# Altium project WT32-RJ45.PrjPcb (part 2 of 2)

## Sheet LED_Sheet.SchDoc
size 420 x 297 mm; SheetNumber: 3; SheetTotal: 3
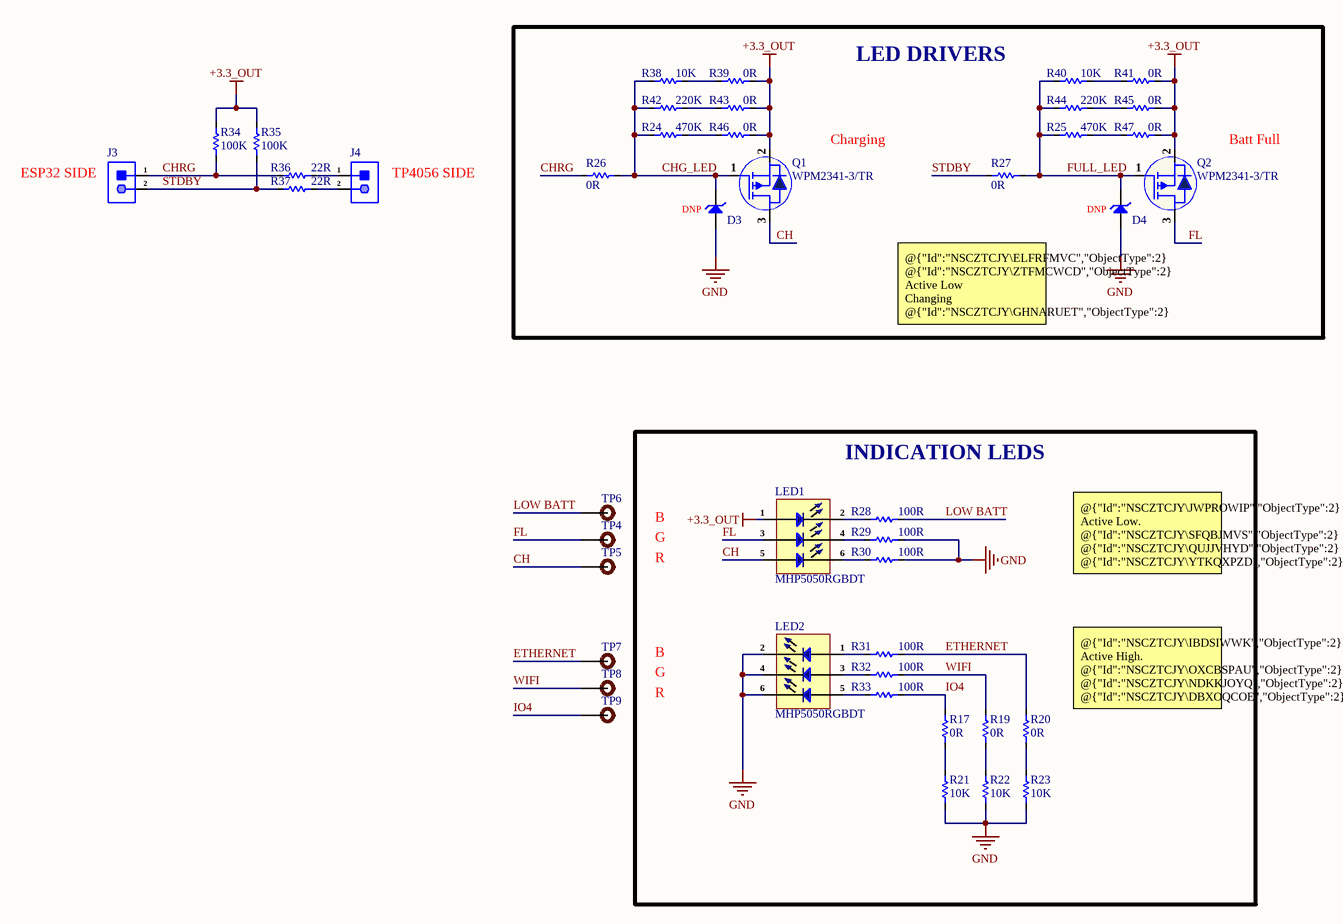
[diagram p2: LED_Sheet.SchDoc]

### Parts
D3  MM3Z3V3  [SOD-323]  (value not drawn)  (no BOM)
D4  MM3Z3V3  [SOD-323]  (value not drawn)  (no BOM)
J3  826629-2  [HDR1X2_]  (value not drawn)
J4  826629-2  [HDR1X2_]  (value not drawn)
LED1  MHP5050RGBDT  [MHP5050RGBDT]
LED2  MHP5050RGBDT  [MHP5050RGBDT]
Q1  WPM2341-3/TR  [Sot-23]
Q2  WPM2341-3/TR  [Sot-23]
R17  0R  [Res-0402]  (no BOM)
R19  0R  [Res-0402]  (no BOM)
R20  0R  [Res-0402]  (no BOM)
R21  10K  [Res-0402]
R22  10K  [Res-0402]
R23  10K  [Res-0402]
R24  470K  [Res-0402]
R25  470K  [Res-0402]
R26  0R  [Res-0402]
R27  0R  [Res-0402]
R28  100R  [Res-0402]
R29  100R  [Res-0402]
R30  100R  [Res-0402]
R31  100R  [Res-0402]
R32  100R  [Res-0402]
R33  100R  [Res-0402]
R34  100K  [Res-0402]
R35  100K  [Res-0402]
R36  22R  [Res-0402]
R37  22R  [Res-0402]
R38  10K  [Res-0402]
R39  0R  [Res-0402]  (no BOM)
R40  10K  [Res-0402]
R41  0R  [Res-0402]  (no BOM)
R42  220K  [Res-0402]
R43  0R  [Res-0402]  (no BOM)
R44  220K  [Res-0402]
R45  0R  [Res-0402]  (no BOM)
R46  0R  [Res-0402]  (no BOM)
R47  0R  [Res-0402]  (no BOM)
TP4  TEST POINT 0.5mm Dia  [Test-point - 0.5mm]  (value not drawn)  (no BOM)
TP5  TEST POINT 0.5mm Dia  [Test-point - 0.5mm]  (value not drawn)  (no BOM)
TP6  TEST POINT 0.5mm Dia  [Test-point - 0.5mm]  (value not drawn)  (no BOM)
TP7  TEST POINT 0.5mm Dia  [Test-point - 0.5mm]  (value not drawn)  (no BOM)
TP8  TEST POINT 0.5mm Dia  [Test-point - 0.5mm]  (value not drawn)  (no BOM)
TP9  TEST POINT 0.5mm Dia  [Test-point - 0.5mm]  (value not drawn)  (no BOM)

### Blocks framed on the sheet
LED DRIVERS: D3 D4 Q1 Q2 R24-R27 R38-R47
INDICATION LEDS: LED1 LED2 R17 R19-R23 R28-R33

### Nets
+3.3_OUT: LED1.1 Q1.2(S) Q2.2(S) R34.2 R35.2 R39.1 R41.1 R43.1 R45.1 R46.1 R47.1
GND: D3.2(A) D4.2(A) LED2.2 LED2.4 LED2.6 R21.1 R22.1 R23.1 R29.2 R30.2
CH: LED1.5 Q1.3(D) TP5.1
CHG_LED: D3.1(K) Q1.1(G) R24.1 R26.2 R38.2 R42.1
CHRG: J3.1 R26.1 R34.1 R36.1
ETHERNET: R20.2 R31.2 TP7.1
FL: LED1.3 Q2.3(D) TP4.1
FULL_LED: D4.1(K) Q2.1(G) R25.1 R27.2 R40.2 R44.1
IO4: R17.2 R33.2 TP9.1
LOW BATT: R28.2 TP6.1
STDBY: J3.2 R27.1 R35.1 R37.1
WIFI: R19.2 R32.2 TP8.1
NetJ4_1: J4.1 R36.2
NetJ4_2: J4.2 R37.2
NetLED1_2: LED1.2 R28.1
NetLED1_4: LED1.4 R29.1
NetLED1_6: LED1.6 R30.1
NetLED2_1: LED2.1 R31.1
NetLED2_3: LED2.3 R32.1
NetLED2_5: LED2.5 R33.1
NetR17_1: R17.1 R21.2
NetR19_1: R19.1 R22.2
NetR20_1: R20.1 R23.2
NetR24_2: R24.2 R46.2
NetR25_2: R25.2 R47.2
NetR38_1: R38.1 R39.2
NetR40_1: R40.1 R41.2
NetR42_2: R42.2 R43.2
NetR44_2: R44.2 R45.2

### Notes on the sheet
- (near J3) ESP32 SIDE
- (near J4) TP4056 SIDE
- Charging
- Batt Full
- (near D3) DNP
- (near D4) DNP
- @{"Id":"NSCZTCJY\ELFRFMVC","ObjectType":2} @{"Id":"NSCZTCJY\ZTFMCWCD","ObjectType":2} Active Low
  Changing @{"Id":"NSCZTCJY\GHNARUET","ObjectType":2} & @{"Id":"NSCZTCJY\CBAYZRLV","ObjectType":2} from 1M to 500k.
- B
- R
- G
- @{"Id":"NSCZTCJY\JWPROWIP","ObjectType":2} Active Low.
  @{"Id":"NSCZTCJY\SFQBJMVS","ObjectType":2} @{"Id":"NSCZTCJY\QUJJVHYD","ObjectType":2} @{"Id":"NSCZTCJY\YTKQXPZD","ObjectType":2} Changed from 470R to 100R
- (near R20) @{"Id":"NSCZTCJY\IBDSIWWK","ObjectType":2} Active High.
  @{"Id":"NSCZTCJY\OXCBSPAU","ObjectType":2} @{"Id":"NSCZTCJY\NDKKJOYQ","ObjectType":2} @{"Id":"NSCZTCJY\DBXOQCOE","ObjectType":2} Changed from 470R to 100R
- PROJECT
- TITLE
- SCALE:
- A3
- SIZE
- FILE NAME
- SHEET
- OF
- REV

### Library data of the parts
D3 D4 = MM3Z3V3: ±5% Single 3.1V~3.5V 300mW 3.3V SOD-323 Zener Diodes ROHS; Manufacturer: JSMSEMI; Item Type: Diode; ComponentLink1Description: LCSC; ComponentLink1URL: https://www.lcsc.com/product-detail/Zener-Diodes_Shandong-Jingdao-Microelectronics-MM3Z3V3_C123917.html; Manufacturer Part Number: MM3Z3V3; Package: SOD-323; LCSC Part Number: C123917
J3 J4 = 826629-2: CONN HEADER VERT 2POS 2.54MM; Manufacturer: TE Connectivity; Manufacturer Part Number: 8266292; Number of Contacts: 2; Connector Type: Plug,Header,Pin; Current Rating: 3A; Board Standoff: No (Without); High Speed Serial Data Connector: No; PCB Mount Retention: Without; Gender: Male; PCB Mounting Orientation: Vertical; Contact Post Length: 0.1259inch; Plating Thickness: 0.8um; Item Type: Male Header; Supplier 1: RSComponents; RoHS: Yes; Category: Board to Board Connectors; Mount: Straddle Mount; Contact Plating: Gold,Tin; Contact Material: Bronze; Color: Green; Housing Color: Green; Housing Material: PBT; Contact Shape: Square; Min Operating Temperature: -65°C; Max Operating Temperature: 105°C; Number of Rows: 1; Termination: Through Hole; Number of Positions: 2; Packaging: Carton; Package Quantity: 3000; Series: AMPMODU MOD II; Contact Type: Male Pin; Contact Gender: Male; Orientation: Straight; Contact Protection: No (Without); Gasket: No (Without); High Temperature Housing: No; Keyed: No; Mating Alignment: No (Without); Mating Connector Lock: No (Without); Selectively Loaded: No (Without); Stabilizers: No (Without); Strain Relief: No (Without); Length: 5.08mm; Pitch: 2.54mm; Contact Mating Length: 6.7mm; Row Spacing: 2.54mm; Depth: 2.5mm; Radiation Hardening: No; Flammability Rating: UL94 V-0; REACH SVHC: No SVHC; ELV: Compliant; Lead Free: Lead Free; ComponentLink1URL: https://datasheet.ciiva.com/11746/0900766b80d7c358-11746248.pdf?src-supplier=RSComponents; ComponentLink1Description: https://datasheet.ciiva.com/11746/0900766b80d7c358-11746248.pdf?src-supplier=RSComponents; ComponentLink2URL: https://datasheet.ciiva.com/30224/8266292-30224019.pdf?src-supplier=Onlinecomponents.com; ComponentLink2Description: https://datasheet.ciiva.com/30224/8266292-30224019.pdf?src-supplier=Onlinecomponents.com; ComponentLink3URL: https://datasheet.ciiva.com/29369/001094754-da-01-en-stiftleiste-1-reihig-0-0826629-2-29369600.pdf?src-supplier=Conrad; ComponentLink3Description: https://datasheet.ciiva.com/29369/001094754-da-01-en-stiftleiste-1-reihig-0-0826629-2-29369600.pdf?src-supplier=Conrad; ComponentLink4URL: https://datasheet.ciiva.com/6857/eng-cd-826629-aa-basefilename-6857135.pdf?src-supplier=Digi-Key; ComponentLink4Description: https://datasheet.ciiva.com/6857/eng-cd-826629-aa-basefilename-6857135.pdf?src-supplier=Digi-Key; ComponentLink5URL: https://datasheet.ciiva.com/14120/eh826629-draw-14120837.pdf?src-supplier=Distrelec; ComponentLink5Description: https://datasheet.ciiva.com/14120/eh826629-draw-14120837.pdf?src-supplier=Distrelec; Supplier Part Number 1: 1361864; LCSC Part Number: C86471
LED1 LED2 = MHP5050RGBDT: 20mA White Diffused -40℃~+85℃ RGB SMD5050 Light Emitting Diodes (LED) ROHS; Manufacturer: MEIHUA; Item Type: RGB LED; Manufacturer Part Number: MHP5050RGBDT; LCSC Part Number: C409780; Package: SMD5050; ComponentLink1Description: LCSC; ComponentLink1URL: https://www.lcsc.com/product-detail/Light-Emitting-Diodes-LED_MEIHUA-MHP5050RGBDT_C409780.html
Q1 Q2 = WPM2341-3/TR: 20V 3.5A 750mW 61mΩ@4.5V,3.3A 1V@250uA 1PCSPChannel SOT-23 MOSFETs ROHS; Manufacturer: WILLSEMI; Item Type: Mosfet; Manufacturer Part Number: WPM2341-3/TR; Package: SOT-23; LCSC Part Number: C167138; ComponentLink1Description: LCSC; ComponentLink1URL: https://www.lcsc.com/product-detail/MOSFETs_WILLSEMI-Will-Semicon-WPM2341-3-TR_C167138.html
R17 R19 R20 R39 R41 R43 R45-R47 = AC0402FR-070RL: RESISTOR 0402 JUMPER ZERO OHM; Manufacturer: Yageo; Voltage Rating: 50V; Power Rating: 62.5mW; Tolerance: 1%; Temperature Coefficient: 200ppm/°C; Supplier: Digi-Key; Supplier Part Number: 13-AC0402FR-070RLDKR-ND; Manufacturer Part Number: AC0402FR-070RL; RoHS: Yes; Category: Chip SMD Resistors; Stock: 337140; Pricing: 1=0.1, 10=0.017, 25=0.0132, 50=0.01, 100=0.0071, 250=0.00568, 500=0.00454, 1000=0.00335, 5000=0.0024 (USD); Case/Package: 0402; Case Code (Imperial): 0402; Case Code (Metric): 1005; Min Operating Temperature: -55°C; Max Operating Temperature: 155°C; Value: 0R; Packaging: Tape and Reel; Termination: SMD/SMT; Series: AC; Height: 370um; ComponentLink1URL: https://datasheet.ciiva.com/12656/pyu-ac-51-rohs-l-2-12656734.pdf?src-supplier=Mouser; ComponentLink1Description: https://datasheet.ciiva.com/12656/pyu-ac-51-rohs-l-2-12656734.pdf?src-supplier=Mouser; LCSC Part Number: C226739; Item Type: Resistor; ComponentLink2Description: LCSC; ComponentLink2URL: https://www.lcsc.com/product-detail/Chip-Resistor-Surface-Mount_YAGEO-AC0402FR-070RL_C226739.html
R21-R23 R38 R40 = RC0402FR-0710KL: RES 10K OHM 1% 1/16W 0402; Manufacturer: Yageo; Resistance: 10kR; Voltage Rating (DC): 50V; Temperature Coefficient: 100ppm/°C; Power Rating: 62.5mW; Max Power Dissipation: 63mW; Item Type: Resistor; Supplier 1: Mouser; Manufacturer Part Number: RC0402FR-0710KL; RoHS: Yes; Category: Chip SMD Resistors; Stock 1: 18648329; Pricing 1: 1=0.10000, 10=0.01400, 50=0.01400, 100=0.00500, 1000=0.00300, 10000=0.00200 (USD); Case/Package: 0402; Number of Pins: 2; Case Code (Imperial): 0402; Case Code (Metric): 1005; Min Operating Temperature: -55°C; Max Operating Temperature: 155°C; Resistor Type: Thick Film; Tolerance: 1%; Packaging: Tape and Reel; Voltage Rating: 50V; Termination: SMD/SMT; Working Voltage: 50V; Number of Terminations: 2; Features: Moisture Resistant; Series: RC; Resistance Tolerance: 1%; Construction: Rectangular; Length: 1mm; Width: 0.5mm; Height: 0.32mm; Depth: 0.5mm; Lead Pitch: 0.2mm; REACH SVHC: No SVHC; Lead Free: Lead Free; RoHS Compliant: Yes; Military Standard: Not; ComponentLink1URL: https://datasheet.ciiva.com/7660/38568-7660787.pdf?src-supplier=Element14; ComponentLink1Description: https://datasheet.ciiva.com/7660/38568-7660787.pdf?src-supplier=Element14; ComponentLink2URL: https://datasheet.ciiva.com/7849/1686128-7849814.pdf?src-supplier=Element14; ComponentLink2Description: https://datasheet.ciiva.com/7849/1686128-7849814.pdf?src-supplier=Element14; ComponentLink3URL: https://datasheet.ciiva.com/7983/1018594-7983486.pdf?src-supplier=Element14; ComponentLink3Description: https://datasheet.ciiva.com/7983/1018594-7983486.pdf?src-supplier=Element14; ComponentLink4URL: https://datasheet.ciiva.com/22747/1018594-22747512.pdf?src-supplier=Element14; ComponentLink4Description: https://datasheet.ciiva.com/22747/1018594-22747512.pdf?src-supplier=Element14; ComponentLink5URL: https://datasheet.ciiva.com/12667/pyu-rc0402-51-rohs-l-6-r-12667067.pdf?src-supplier=Mouser; ComponentLink5Description: https://datasheet.ciiva.com/12667/pyu-rc0402-51-rohs-l-6-r-12667067.pdf?src-supplier=Mouser; ComponentLink6URL: https://datasheet.ciiva.com/7849/1784430-7849813.pdf?src-supplier=Element14; ComponentLink6Description: https://datasheet.ciiva.com/7849/1784430-7849813.pdf?src-supplier=Element14; ComponentLink7URL: https://datasheet.ciiva.com/7849/1784430-7849815.pdf?src-supplier=Element14; ComponentLink7Description: https://datasheet.ciiva.com/7849/1784430-7849815.pdf?src-supplier=Element14; Supplier Part Number 1: 603-RC0402FR-0710KL; LCSC Part Number: C60490
R24 R25 = RC0402FR-07470KL: RES 470K OHM 1% 1/16W 0402; Manufacturer: Yageo; Value: 470kR; Power Rating: 62.5mW; Voltage Rating: 50V; Temperature Coefficient: 100ppm/°C; Max Power Dissipation: 63mW; Item Type: Resistor; Supplier: Future Electronics; Supplier Part Number: 7702467; Manufacturer Part Number: RC0402FR-07470KL; RoHS: Yes; Category: Chip SMD Resistors; Stock: 330000; Pricing: 10000=0.0009, 50000=0.0008, 300000=0.0008, 1000000=0.0007, 3000000=0.0007 (USD); Case/Package: 0402; Pins: 2; Case Code (Imperial): 0402; Case Code (Metric): 1005; Min Operating Temperature: -55°C; Max Operating Temperature: 155°C; Tolerance: 1%; Packaging: Tape and Reel; Voltage Rating (DC): 50V; Package Quantity: 1; Termination: SMD/SMT; Resistor Type: Thick Film; Number of Terminations: 2; Features: Moisture Resistant; Series: RC; Resistance Tolerance: 1%; Construction: Rectangular; Technology: THICK FILM; Voltage Rating (AC): 50V; Length: 0.039inch; Width: 0.02inch; Height: 0.016inch; Depth: 0.5mm; RoHS Compliant: Yes; Reach SVHC Compliant: No; Military Standard: Not; Lead Free: 5697LeadFree; ComponentLink1URL: https://datasheet.ciiva.com/11819/0900766b80c66297-11819514.pdf?src-supplier=Rs; ComponentLink1Description: https://datasheet.ciiva.com/11819/0900766b80c66297-11819514.pdf?src-supplier=Rs; ComponentLink2URL: https://datasheet.ciiva.com/46412/1018594-46412837.pdf?src-supplier=Element14; ComponentLink2Description: https://datasheet.ciiva.com/46412/1018594-46412837.pdf?src-supplier=Element14; ComponentLink3URL: https://datasheet.ciiva.com/2453/pyu-r-int-thick-7-2453434.pdf?src-supplier=Digi-Key; ComponentLink3Description: https://datasheet.ciiva.com/2453/pyu-r-int-thick-7-2453434.pdf?src-supplier=Digi-Key; ComponentLink4URL: https://datasheet.ciiva.com/2453/pyu-r-int-thick-7-2453435.pdf?src-supplier=Digi-Key; ComponentLink4Description: https://datasheet.ciiva.com/2453/pyu-r-int-thick-7-2453435.pdf?src-supplier=Digi-Key; ComponentLink5URL: https://datasheet.ciiva.com/2453/pyu-r-int-thick-7-2453433.pdf?src-supplier=Digi-Key; ComponentLink5Description: https://datasheet.ciiva.com/2453/pyu-r-int-thick-7-2453433.pdf?src-supplier=Digi-Key; ComponentLink6URL: https://datasheet.ciiva.com/7850/1018594-7850012.pdf?src-supplier=Element14; ComponentLink6Description: https://datasheet.ciiva.com/7850/1018594-7850012.pdf?src-supplier=Element14; ComponentLink7URL: https://datasheet.ciiva.com/7850/1018594-7850013.pdf?src-supplier=Element14; ComponentLink7Description: https://datasheet.ciiva.com/7850/1018594-7850013.pdf?src-supplier=Element14; ComponentLink8URL: https://datasheet.ciiva.com/15189/getdatasheetpartid-325138-15189462.pdf?src-supplier=Verical; ComponentLink8Description: https://datasheet.ciiva.com/15189/getdatasheetpartid-325138-15189462.pdf?src-supplier=Verical; LCSC Part Number: C137976
R26 R27 = RC0402FR-070RL: RES 0 OHM JUMPER 1/16W 0402; Manufacturer: Yageo; Item Type: Resistors; Tolerance: 1%; Power Rating: 62.5mW; Voltage Rating: 50V; Temperature Coefficient: 200ppm/°C; Max Power Dissipation: 63mW; Supplier 1: Mouser; Manufacturer Part Number: RC0402FR-070RL; RoHS: Yes; Stock 1: 8556842; Pricing 1: 1=0.10000, 10=0.01400, 50=0.01400, 100=0.00600, 1000=0.00300, 5000=0.00200, 10000=0.00100 (USD); Mount: Surface Mount; Case/Package: 0402; Contact Plating: Tin,Matte; Case Code (Imperial): 0402; Case Code (Metric): 1005; Size Code: 0402; Min Operating Temperature: -55°C; Max Operating Temperature: 155°C; Resistance: 0R; Resistor Type: Thick Film; Packaging: Tape and Reel; Termination: SMD/SMT; Features: Moisture Resistant; Series: RC; Number of Terminations: 2; Length: 1mm; Width: 0.5mm; Height: 0.35mm; Radiation Hardening: No; Lead Free: Lead Free; RoHS Compliant: Yes; ComponentLink1URL: https://datasheet.ciiva.com/8896/pyu-rc0402-51-rohs-l-6-8896149.pdf?src-supplier=Avnet; ComponentLink1Description: https://datasheet.ciiva.com/8896/pyu-rc0402-51-rohs-l-6-8896149.pdf?src-supplier=Avnet; ComponentLink2URL: https://datasheet.ciiva.com/16790/pyu-rc0402-51-rohs-l-6-r-16790444.pdf?src-supplier=Future+Electronics; ComponentLink2Description: https://datasheet.ciiva.com/16790/pyu-rc0402-51-rohs-l-6-r-16790444.pdf?src-supplier=Future+Electronics; Supplier Part Number 1: 603-RC0402FR-070RL; LCSC Part Number: C106231
R28-R33 = RC0402FR-07100RL: RES 100 OHM 1% 1/16W 0402; Manufacturer: Yageo; Power Rating: 62.5mW; Voltage Rating: 50V; Temperature Coefficient: 100ppm/°C; Max Power Dissipation: 63mW; Item Type: Resistor; Supplier 1: Mouser; Manufacturer Part Number: RC0402FR-07100RL; RoHS: Yes; Category: Chip SMD Resistors; Stock 1: 699545; Pricing 1: 1=0.10000, 10=0.01200, 50=0.01200, 100=0.00500, 1000=0.00300, 2500=0.00200, 10000=0.00100 (USD); Case/Package: 0402; Number of Pins: 2; Case Code (Imperial): 0402; Case Code (Metric): 1005; Size Code: 0402; Min Operating Temperature: -55°C; Max Operating Temperature: 155°C; Tolerance: 1%; Voltage Rating (DC): 50V; Resistance: 100R; Packaging: Tape and Reel; Termination: SMD/SMT; Resistor Type: Thick Film; Features: Moisture Resistant; Series: RC; Number of Terminations: 2; Resistance Tolerance: 1%; Construction: Rectangular; Technology: THICK FILM; Length: 1mm; Width: 0.5mm; Height: 0.32mm; Depth: 0.5mm; RoHS Compliant: Yes; REACH SVHC: No SVHC; Military Standard: Not; Lead Free: Lead Free; ComponentLink1URL: https://datasheet.ciiva.com/11808/0900766b80c66297-11808765.pdf?src-supplier=RSComponents; ComponentLink1Description: https://datasheet.ciiva.com/11808/0900766b80c66297-11808765.pdf?src-supplier=RSComponents; ComponentLink2URL: https://datasheet.ciiva.com/7849/1784430-7849810.pdf?src-supplier=Element14; ComponentLink2Description: https://datasheet.ciiva.com/7849/1784430-7849810.pdf?src-supplier=Element14; ComponentLink3URL: https://datasheet.ciiva.com/28367/1018594-28367226.pdf?src-supplier=Element14; ComponentLink3Description: https://datasheet.ciiva.com/28367/1018594-28367226.pdf?src-supplier=Element14; ComponentLink4URL: https://datasheet.ciiva.com/22747/1018594-22747511.pdf?src-supplier=Element14; ComponentLink4Description: https://datasheet.ciiva.com/22747/1018594-22747511.pdf?src-supplier=Element14; ComponentLink5URL: https://datasheet.ciiva.com/12667/pyu-rc0402-51-rohs-l-6-r-12667957.pdf?src-supplier=Mouser; ComponentLink5Description: https://datasheet.ciiva.com/12667/pyu-rc0402-51-rohs-l-6-r-12667957.pdf?src-supplier=Mouser; ComponentLink6URL: https://datasheet.ciiva.com/15189/getdatasheetpartid-329466-15189335.pdf?src-supplier=Verical; ComponentLink6Description: https://datasheet.ciiva.com/15189/getdatasheetpartid-329466-15189335.pdf?src-supplier=Verical; ComponentLink7URL: https://datasheet.ciiva.com/16740/pyu-rc0402-51-rohs-l-6-r-16740566.pdf?src-supplier=Future+Electronics; ComponentLink7Description: https://datasheet.ciiva.com/16740/pyu-rc0402-51-rohs-l-6-r-16740566.pdf?src-supplier=Future+Electronics; Supplier Part Number 1: 603-RC0402FR-07100RL; LCSC Part Number: C106232
R34 R35 = RC0402FR-07100KL: RES 100K OHM 1% 1/16W 0402; Manufacturer: Yageo; Resistance: 100kR; Temperature Coefficient: 100ppm/°C; Power Rating: 63mW; Voltage Rating: 50V; Item Type: Resistor; Supplier 1: Mouser; Manufacturer Part Number: RC0402FR-07100KL; RoHS: Yes; Category: Chip SMD Resistors; Stock 1: 7759549; Pricing 1: 1=0.10000, 10=0.01200, 50=0.01200, 100=0.00500, 1000=0.00300, 2500=0.00200, 10000=0.00100 (USD); Case/Package: 0402; Case Code (Metric): 1005; Case Code (Imperial): 0402; Min Operating Temperature: -55°C; Max Operating Temperature: 155°C; Resistor Type: Thick Film; Tolerance: 1%; Packaging: Tape and Reel; Package Quantity: 1; Number of Terminations: 2; Termination: SMD/SMT; Max Power Dissipation: 63mW; Working Voltage: 50V; Features: Moisture Resistant; Series: RC; Resistance Tolerance: 1%; Construction: Rectangular; Technology: THICK FILM; Length: 0.039inch; Width: 0.02inch; Height: 0.016inch; Depth: 0.5mm; REACH SVHC: No SVHC; Lead Free: Lead Free; RoHS Compliant: Yes; Military Standard: Not; ComponentLink1URL: https://datasheet.ciiva.com/11819/0900766b80c66297-11819452.pdf?src-supplier=RSComponents; ComponentLink1Description: https://datasheet.ciiva.com/11819/0900766b80c66297-11819452.pdf?src-supplier=RSComponents; ComponentLink2URL: https://datasheet.ciiva.com/22747/1018594-22747509.pdf?src-supplier=Element14; ComponentLink2Description: https://datasheet.ciiva.com/22747/1018594-22747509.pdf?src-supplier=Element14; ComponentLink3URL: https://datasheet.ciiva.com/2453/pyu-r-int-thick-7-2453362.pdf?src-supplier=Digi-Key; ComponentLink3Description: https://datasheet.ciiva.com/2453/pyu-r-int-thick-7-2453362.pdf?src-supplier=Digi-Key; ComponentLink4URL: https://datasheet.ciiva.com/2453/pyu-r-int-thick-7-2453363.pdf?src-supplier=Digi-Key; ComponentLink4Description: https://datasheet.ciiva.com/2453/pyu-r-int-thick-7-2453363.pdf?src-supplier=Digi-Key; ComponentLink5URL: https://datasheet.ciiva.com/2453/pyu-r-int-thick-7-2453361.pdf?src-supplier=Digi-Key; ComponentLink5Description: https://datasheet.ciiva.com/2453/pyu-r-int-thick-7-2453361.pdf?src-supplier=Digi-Key; ComponentLink6URL: https://datasheet.ciiva.com/12667/pyu-rc0402-51-rohs-l-6-r-12667930.pdf?src-supplier=Mouser; ComponentLink6Description: https://datasheet.ciiva.com/12667/pyu-rc0402-51-rohs-l-6-r-12667930.pdf?src-supplier=Mouser; ComponentLink7URL: https://datasheet.ciiva.com/15189/getdatasheetpartid-323696-15189334.pdf?src-supplier=Verical; ComponentLink7Description: https://datasheet.ciiva.com/15189/getdatasheetpartid-323696-15189334.pdf?src-supplier=Verical; Supplier Part Number 1: 603-RC0402FR-07100KL; LCSC Part Number: C60491
R36 R37 = RC0402FR-0722RL: RES 22 OHM 1% 1/16W 0402; Manufacturer: Yageo; Voltage Rating: 50V; Power Rating: 62.5mW; Temperature Coefficient: 100ppm/°C; Max Power Dissipation: 63mW; Item Type: Resistor; Supplier 1: Avnet; Manufacturer Part Number: RC0402FR-0722RL; RoHS: Yes; Category: Chip SMD Resistors; Stock 1: 1810000; Pricing 1: 10000=0.00085 (USD); Case/Package: 0402; Number of Pins: 2; Case Code (Imperial): 0402; Case Code (Metric): 1005; Size Code: 0402; Min Operating Temperature: -55°C; Max Operating Temperature: 155°C; Resistor Type: Thick Film; Voltage Rating (DC): 50V; Resistance: 22R; Tolerance: 1%; Packaging: Tape and Reel; Termination: SMD/SMT; Features: Moisture Resistant; Series: RC; Number of Terminations: 2; Resistance Tolerance: 1%; Technology: THICK FILM; Construction: Rectangular; Length: 1mm; Width: 0.5mm; Height: 0.32mm; Depth: 0.5mm; RoHS Compliant: Yes; Reach SVHC Compliant: Yes; Military Standard: Not; Lead Free: Lead Free; ComponentLink1URL: https://datasheet.ciiva.com/11819/0900766b80c66297-11819462.pdf?src-supplier=RSComponents; ComponentLink1Description: https://datasheet.ciiva.com/11819/0900766b80c66297-11819462.pdf?src-supplier=RSComponents; ComponentLink2URL: https://datasheet.ciiva.com/7849/1018594-7849912.pdf?src-supplier=Element14; ComponentLink2Description: https://datasheet.ciiva.com/7849/1018594-7849912.pdf?src-supplier=Element14; ComponentLink3URL: https://datasheet.ciiva.com/7849/1018594-7849911.pdf?src-supplier=Element14; ComponentLink3Description: https://datasheet.ciiva.com/7849/1018594-7849911.pdf?src-supplier=Element14; ComponentLink4URL: https://datasheet.ciiva.com/16930/pyu-rc0402-51-rohs-l-6-r-16930687.pdf?src-supplier=Future+Electronics; ComponentLink4Description: https://datasheet.ciiva.com/16930/pyu-rc0402-51-rohs-l-6-r-16930687.pdf?src-supplier=Future+Electronics; ComponentLink5URL: https://datasheet.ciiva.com/26829/getdatasheetpartid-554995-26829991.pdf?src-supplier=Verical; ComponentLink5Description: https://datasheet.ciiva.com/26829/getdatasheetpartid-554995-26829991.pdf?src-supplier=Verical; Supplier Part Number 1: RC0402FR-0722RL; LCSC Part Number: C114765
R42 R44 = RC0402FR-07220KL: RES 220K OHM 1% 1/16W 0402; Manufacturer: Yageo; Resistance: 220kR; Power Rating: 62.5mW; Voltage Rating: 50V; Temperature Coefficient: 100ppm/°C; Max Power Dissipation: 63mW; Item Type: Resistor; Supplier 1: Arrow Electronics; Manufacturer Part Number: RC0402FR-07220KL; RoHS: Yes; Category: Chip SMD Resistors; Stock 1: 210000; Pricing 1: 10000=0.00130 (USD); Case/Package: 0402; Case Code (Imperial): 0402; Case Code (Metric): 1005; Weight: 2.3E-05oz; Size Code: 0402; Min Operating Temperature: -55°C; Max Operating Temperature: 155°C; Tolerance: 1%; Package Quantity: 1; Packaging: Tape and Reel; Termination: SMD/SMT; Resistor Type: Thick Film; Number of Terminations: 2; Features: Moisture Resistant; Series: RC; Resistance Tolerance: 1%; Technology: THICK FILM; Construction: Rectangular; Length: 1mm; Width: 0.02inch; Height: 0.016inch; Depth: 0.5mm; RoHS Compliant: Yes; Reach SVHC Compliant: Yes; Military Standard: Not; Lead Free: Lead Free; ComponentLink1URL: https://datasheet.ciiva.com/11808/0900766b80c66297-11808792.pdf?src-supplier=RSComponents; ComponentLink1Description: https://datasheet.ciiva.com/11808/0900766b80c66297-11808792.pdf?src-supplier=RSComponents; ComponentLink2URL: https://datasheet.ciiva.com/5924/1018594-5924944.pdf?src-supplier=Farnell; ComponentLink2Description: https://datasheet.ciiva.com/5924/1018594-5924944.pdf?src-supplier=Farnell; ComponentLink3URL: https://datasheet.ciiva.com/2453/pyu-r-int-thick-7-2453533.pdf?src-supplier=Digi-Key; ComponentLink3Description: https://datasheet.ciiva.com/2453/pyu-r-int-thick-7-2453533.pdf?src-supplier=Digi-Key; ComponentLink4URL: https://datasheet.ciiva.com/2453/pyu-r-int-thick-7-2453534.pdf?src-supplier=Digi-Key; ComponentLink4Description: https://datasheet.ciiva.com/2453/pyu-r-int-thick-7-2453534.pdf?src-supplier=Digi-Key; ComponentLink5URL: https://datasheet.ciiva.com/2453/pyu-r-int-thick-7-2453532.pdf?src-supplier=Digi-Key; ComponentLink5Description: https://datasheet.ciiva.com/2453/pyu-r-int-thick-7-2453532.pdf?src-supplier=Digi-Key; ComponentLink6URL: https://datasheet.ciiva.com/12577/pyu-rc0402-51-rohs-l-6-r-12577270.pdf?src-supplier=Mouser; ComponentLink6Description: https://datasheet.ciiva.com/12577/pyu-rc0402-51-rohs-l-6-r-12577270.pdf?src-supplier=Mouser; Supplier Part Number 1: RC0402FR-07220KL; LCSC Part Number: C138030
TP4-TP9 = TEST POINT 0.5mm Dia: Test Point ON; Item Type: Test Point; Manufacturer Part Number: TEST POINT 0.5mm Dia

## Nets that join several sheets
+3.3_OUT: ESP32 (7 pins), LAN8720A (10 pins), LED_Sheet (11 pins)
GND: ESP32 (20 pins), LAN8720A (19 pins), LED_Sheet (10 pins)
CHG_LED: ESP32 (U1.8), LED_Sheet (6 pins)
CHRG: ESP32 (U1.5), LED_Sheet (J3.1 R26.1 R34.1 R36.1)
ETHERNET: ESP32 (U1.14), LED_Sheet (R20.2 R31.2 TP7.1)
FULL_LED: ESP32 (U1.23), LED_Sheet (6 pins)
IO0: ESP32 (5 pins), LAN8720A (R10.2 U4.14)
IO4: ESP32 (U1.26), LED_Sheet (R17.2 R33.2 TP9.1)
IO13_RMII_EMAC_RX_ER: ESP32 (U1.16), LAN8720A (R11.1 U4.10)
IO16_OSC_EN: ESP32 (U1.27), LAN8720A (R18.1 X1.1)
IO18_RMII_MDIO: ESP32 (U1.30), LAN8720A (R8.1 U4.12)
IO19_RMII_EMAC_TXD0: ESP32 (U1.31), LAN8720A (U4.17)
IO21_RMII_EMAC_TX_EN: ESP32 (U1.33), LAN8720A (U4.16)
IO22_RMII_EMAC_TXD1: ESP32 (U1.36), LAN8720A (U4.18)
IO23_RMII_MDC: ESP32 (U1.37), LAN8720A (U4.13)
IO25_RMII_EMAC_RXD0: ESP32 (U1.10), LAN8720A (U4.8)
IO26_RMII_EMAC_RXD1: ESP32 (U1.11), LAN8720A (U4.7)
IO27_RMII_EMAC_CRS_DV: ESP32 (U1.12), LAN8720A (U4.11)
LOW BATT: ESP32 (U1.13), LED_Sheet (R28.2 TP6.1)
STDBY: ESP32 (U1.4), LED_Sheet (J3.2 R27.1 R35.1 R37.1)
WIFI: ESP32 (U1.24), LED_Sheet (R19.2 R32.2 TP8.1)